# EAGLE schematic kicker (EAGLE 9.6.2)
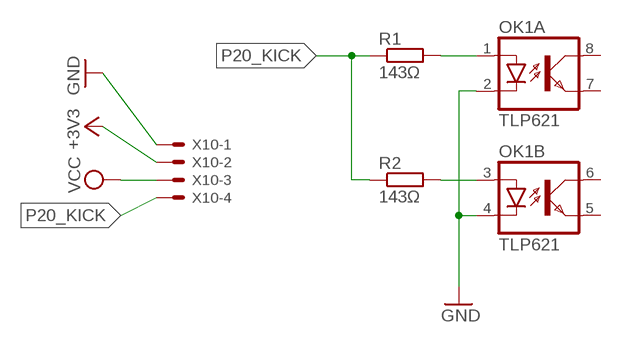
[diagram p0: schematic, sheet 1]

## Parts
OK1  TLP621  PC827  [DIL08]
R1  143Ω  R-EU_0207/10  [0207/10]
R2  143Ω  R-EU_0207/10  [0207/10]
X10  Kicker  JST-XH-04-PIN-ROUND-PAD  [JST-XH-04-PACKAGE-ROUND-PAD]

## Nets
+3V3: X10.2
GND: OK1.2(A:C) OK1.4(B:C) X10.1
N$1: OK1.1(A:A) R1.2
N$2: OK1.3(B:A) R2.2
P20_KICK: R1.1 R2.1 X10.4
VCC: X10.3
Unconnected: OK1.5(B:EMIT) OK1.6(B:COL) OK1.7(A:EMIT) OK1.8(A:COL)

## Library data of the parts
OK1 = optocoupler:PC827: SHARP OPTO COUPLER; OC_FARNELL: unknown; OC_NEWARK: unknown
R1 R2 = rcl:R-EU_: RESISTOR, European symbol; SPICEPREFIX: R
X10 = JST XH Connectors v1-0:JST-XH-04-PIN: JST XH Connector 2 Pin Wire to board connector. Pitch: 2,54 mm, (0.100") Number of pins: 4 Created by Rembrandt Electronics www.rembrandtelectronics.com